# Altium schematic sheet Parallel_Capacitor.SchDoc
size A4
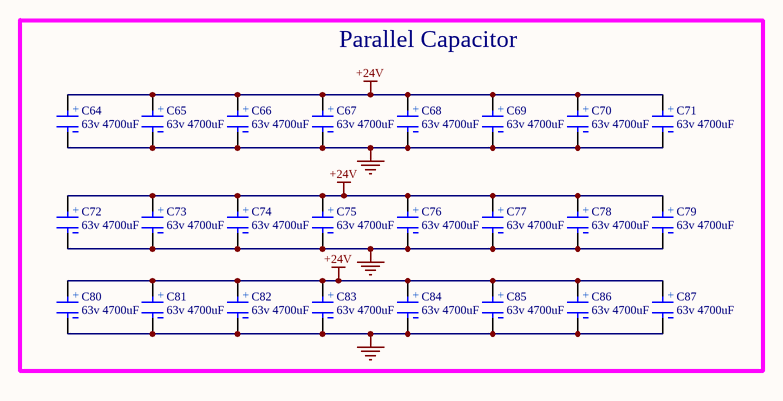
[diagram p0: Parallel_Capacitor.SchDoc]

## Parts
C64  63v 4700uF  [cap 10*20]
C65  63v 4700uF  [cap 10*20]
C66  63v 4700uF  [cap 10*20]
C67  63v 4700uF  [cap 10*20]
C68  63v 4700uF  [cap 10*20]
C69  63v 4700uF  [cap 10*20]
C70  63v 4700uF  [cap 10*20]
C71  63v 4700uF  [cap 10*20]
C72  63v 4700uF  [cap 10*20]
C73  63v 4700uF  [cap 10*20]
C74  63v 4700uF  [cap 10*20]
C75  63v 4700uF  [cap 10*20]
C76  63v 4700uF  [cap 10*20]
C77  63v 4700uF  [cap 10*20]
C78  63v 4700uF  [cap 10*20]
C79  63v 4700uF  [cap 10*20]
C80  63v 4700uF  [cap 10*20]
C81  63v 4700uF  [cap 10*20]
C82  63v 4700uF  [cap 10*20]
C83  63v 4700uF  [cap 10*20]
C84  63v 4700uF  [cap 10*20]
C85  63v 4700uF  [cap 10*20]
C86  63v 4700uF  [cap 10*20]
C87  63v 4700uF  [cap 10*20]

## Blocks framed on the sheet
Parallel Capacitor: C64-C87

## Nets
+24V: C64.1 C65.1 C66.1 C67.1 C68.1 C69.1 C70.1 C71.1 C72.1 C73.1 C74.1 C75.1 C76.1 C77.1 C78.1 C79.1 C80.1 C81.1 C82.1 C83.1 C84.1 C85.1 C86.1 C87.1
GND: C64.2 C65.2 C66.2 C67.2 C68.2 C69.2 C70.2 C71.2 C72.2 C73.2 C74.2 C75.2 C76.2 C77.2 C78.2 C79.2 C80.2 C81.2 C82.2 C83.2 C84.2 C85.2 C86.2 C87.2

## Notes on the sheet
- (in symbol capacitor 10*20) +

## Library data of the parts
C64-C87 = capacitor 10*20: PKL5-063V472MM450 Aluminum Electrolytic Capacitors - Snap In 63volts 4700uF 20%; Manufacturer: Nichicon; Manufacturer Part Number: LKS1J472MESZ; Capacitance: 4.7mF; Ripple Current: 3A; Life (Hours): 1000Hour; Supplier 1: Mouser; RoHS: Yes; Mount: Through Hole; Case/Package: Radial; Min Operating Temperature: -40°C; Max Operating Temperature: 85°C; Package Quantity: 250; Voltage Rating: 63V; Tolerance: 20%; Packaging: Bulk; Voltage Rating (DC): 63V; Termination: Snap in; Diameter: 22mm; Length: 45mm; Lead Pitch: 0.394inch; Height - Seated (Max): 1.772inch; Supplier Part Number 1: 647-LKS1J472MESZ; ComponentLink2Description: https://www.ozdisan.com/pasif-komponentler/kondansatorler/aluminyum-kondansatorler/PKL5-063V472MM450; ComponentLink2URL: https://www.ozdisan.com/pasif-komponentler/kondansatorler/aluminyum-kondansatorler/PKL5-063V472MM450